# Altium project USB_Docking_Station.PrjPcb
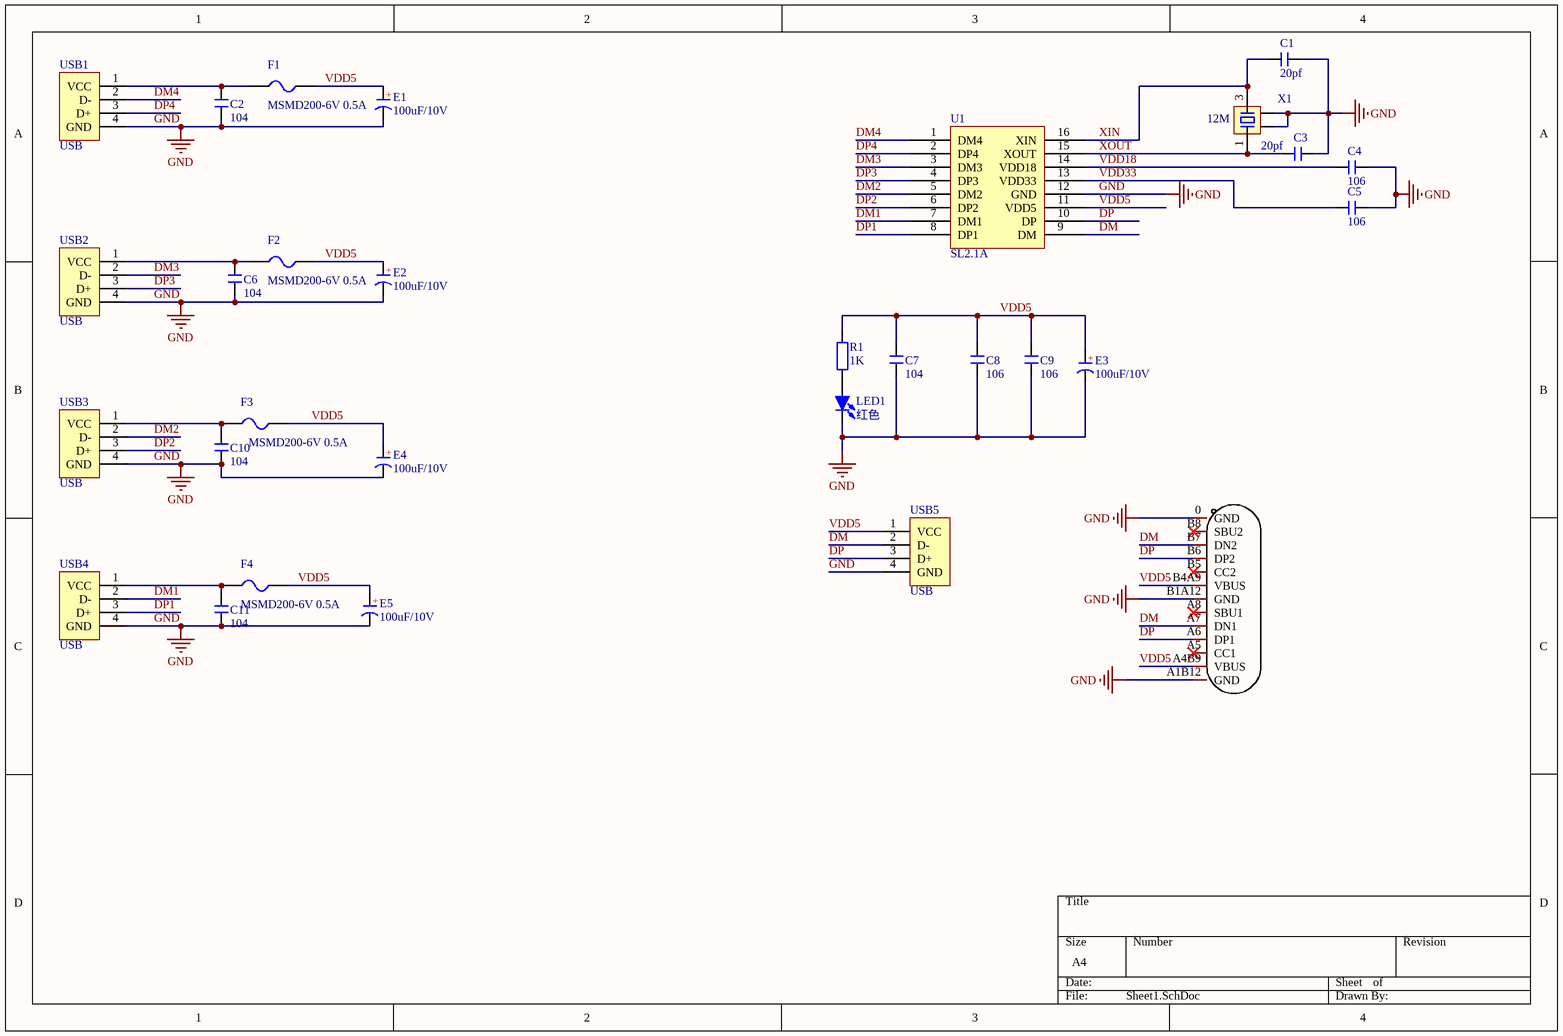
[diagram p0: Sheet1.SchDoc]
1 sheet, 30 parts. Net scope: global (net labels, ports and power ports of the same name join across sheets).
Board file: PCB1.PcbDoc

## Sheet Sheet1.SchDoc
size A4

### Parts
C1  20pf  [C 0603_L]
C2  104  [C 0603_L]
C3  20pf  [C 0603_L]
C4  106  [C 0603_L]
C5  106  [C 0603_L]
C6  104  [C 0603_L]
C7  104  [C 0603_L]
C8  106  [C 0603_L]
C9  106  [C 0603_L]
C10  104  [C 0603_L]
C11  104  [C 0603_L]
E1  100uF/10V  [CM C(5*5.4)]
E2  100uF/10V  [CM C(5*5.4)]
E3  100uF/10V  [CM C(5*5.4)]
E4  100uF/10V  [CM C(5*5.4)]
E5  100uF/10V  [CM C(5*5.4)]
F1  MSMD200-6V 0.5A  [FU 0603]
F2  MSMD200-6V 0.5A  [FU 0603]
F3  MSMD200-6V 0.5A  [FU 0603]
F4  MSMD200-6V 0.5A  [FU 0603]
LED1  红色  [LED 0603R]
R1  1K  [R 0603_L]
U1  SL2.1A  [SOP16]
USB1  USB  [USB-A/S_A]
USB2  USB  [USB-A/S_A]
USB3  USB  [USB-A/S_A]
USB4  USB  [USB-A/S_A]
USB5  USB  [USB_A/P_A]
USB??  MC-307  [USB-C-SMD_MC-307]  (value not drawn)
X1  12M  [OSC 3225-4P]

### Nets
GND: C1.1 C2.1 C3.1 C4.1 C5.1 C6.1 C7.1 C8.2 C9.2 C10.2 C11.1 E1.2(K) E2.2(K) E3.2(K) E4.2(K) E5.2(K) LED1.2(K) U1.12(GND) USB1.4(GND) USB2.4(GND) USB3.4(GND) USB4.4(GND) USB5.4(GND) USB??.0(GND) USB??.A1B12(GND) USB??.B1A12(GND) X1.2 X1.4
DM: U1.9(DM) USB5.2(D-) USB??.A7(DN1) USB??.B7(DN2)
DM1: U1.7(DM1) USB4.2(D-)
DM2: U1.5(DM2) USB3.2(D-)
DM3: U1.3(DM3) USB2.2(D-)
DM4: U1.1(DM4) USB1.2(D-)
DP: U1.10(DP) USB5.3(D+) USB??.A6(DP1) USB??.B6(DP2)
DP1: U1.8(DP1) USB4.3(D+)
DP2: U1.6(DP2) USB3.3(D+)
DP3: U1.4(DP3) USB2.3(D+)
DP4: U1.2(DP4) USB1.3(D+)
VDD5: C7.2 C8.1 C9.1 E1.1(A) E2.1(A) E3.1(A) E4.1(A) E5.1(A) F1.2 F2.2 F3.2 F4.2 R1.2 U1.11(VDD5) USB5.1(VCC) USB??.A4B9(VBUS) USB??.B4A9(VBUS)
VDD18: C4.2 U1.14(VDD18)
VDD33: C5.2 U1.13(VDD33)
XIN: C1.2 U1.16(XIN) X1.3
XOUT: C3.2 U1.15(XOUT) X1.1
NetC2_2: C2.2 F1.1 USB1.1(VCC)
NetC6_2: C6.2 F2.1 USB2.1(VCC)
NetC10_1: C10.1 F3.1 USB3.1(VCC)
NetC11_2: C11.2 F4.1 USB4.1(VCC)
NetLED1_1: LED1.1(A) R1.1

Not connected (* = marked no-connect by the designer): USB?? A5(CC1)* A8(SBU1)* B5(CC2)* B8(SBU2)*

### Notes on the sheet
- (in symbol CE_SMD) +

### Library data of the parts
C1-C11 = C: 贴片电容; BOM名称: 无极性贴片电容; 淘宝ID: 封装库来自淘宝 ID：黄晶宝石; 联系售后，技术支持: https://shop463601444.taobao.com; 唯一出售店铺网址: https://shop463601444.taobao.com
E1-E5 = CE_SMD: 贴片电解电容; 版权归属: 封装库来自淘宝 ID：黄晶宝石; BOM名称: 贴片电解电容; 联系售后: https://shop463601444.taobao.com
F1-F4 = FU: 贴片保险丝; 版权归属: 源创客; BOM名称: 贴片保险丝; 学习资源: www.ooocke.com
LED1 = LED-SMD: 贴片LED; 版权归属: 封装库来自淘宝 ID：黄晶宝石; BOM名称: 贴片LED; 学习资源: https://shop463601444.taobao.com
R1 = R: 贴片电阻; 版权归属: 来自淘宝 ID：黄晶宝石; 封装库来自淘宝卖家 ID：黄晶宝石: 其他店铺购入均为盗版，不享受售后技术支持服务，请立即申请退款; BOM名称: 贴片电阻; 联系售后: https://shop463601444.taobao.com
USB1-USB4 = USB-A/S: USB-A型母接口; 版权归属: 源创客; BOM名称: USB-A型母接口; 学习资源: www.ooocke.com
USB5 = USB-A/P: USB-A型公接口; 版权归属: 源创客; BOM名称: USB-A型公接口; 学习资源: www.ooocke.com
USB?? = MC-307: Manufacturer: HANBO(汉博); Symbol: MC-307_C961709; Add into BOM: yes; Connector Type: Type-C; Gender: 母座; Number of Contacts: 16; Number of Ports: 1; Current Rating - Power (Max): 5A; Name: MC-307; Device: MC-307; LCSC Part Name: Type-C 母座 卧贴 三模(过5A)黑胶; Supplier Part: C961709; Manufacturer Part: MC-307; Supplier Footprint: SMD; JLCPCB Part Class: Extended Part; Datasheet: https://atta.szlcsc.com/upload/public/pdf/source/20210810/D161F7C8593FC1CFFFF7BC86D3EAB58D.pdf; Supplier: LCSC; Convert to PCB: yes; Standard: -; Mounting Style: 卧贴; Operating Temperature Range: -30℃~+85℃
X1 = XTAL-4P: 4脚无源晶振; 版权归属: 源创客; 负载电容: CL20pF; BOM名称: 4脚无源晶振; 学习资源: www.ooocke.com